# EAGLE design USB2TTL (EAGLE 6.2)
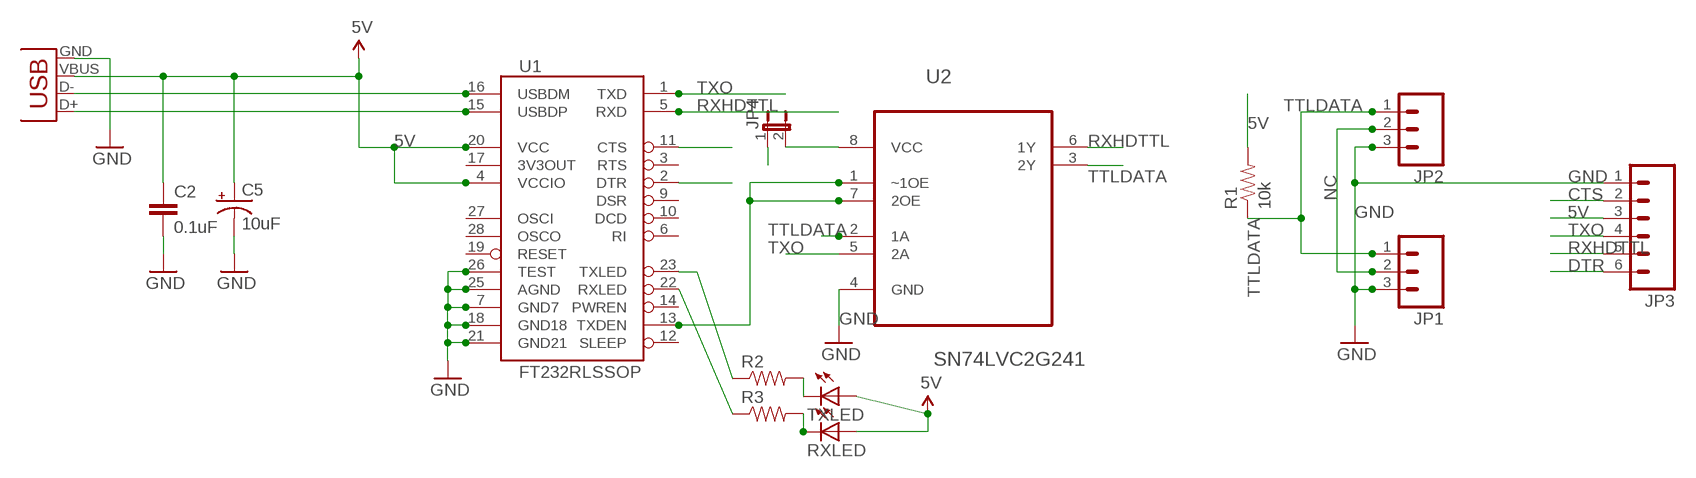
[diagram p0: schematic, sheet 1]

## Parts
C2  0.1uF  CAP0402-CAP  [0402-CAP]
C5  10uF  CAP_POL1206  [EIA3216]
JP1  M03LOCK_LONGPADS  [1X03_LOCK_LONGPADS]
JP2  M03LOCK_LONGPADS  [1X03_LOCK_LONGPADS]
JP3  M06LOCK  [1X06_LOCK]
JP4  JUMPER-2-OLDSMD-NO  [SJ_2S-NO]
R1  10k  RESISTOR0603-RES  [0603-RES]
R2  RESISTOR0603-RES  [0603-RES]
R3  RESISTOR0603-RES  [0603-RES]
RXLED  LED0603  [LED-0603]
TXLED  LED0603  [LED-0603]
U1  FT232RLSSOP  [SSOP28DB]
U2  SN74LVC2G241  [SOP65P400X130-8N]
X2  USB-SMD-NS  [USB-MINIB-NOSTOP]

## Nets
5V: C2.1 C5.A(+) JP3.3 JP4.1 R1.2 RXLED.A TXLED.A U1.4(VCCIO) U1.20(VCC) X2.VBUS
CTS: JP3.2 U1.11(CTS)
DTR: JP3.6 U1.2(DTR)
GND [power]: C2.2 C5.C(-) JP1.3 JP2.3 JP3.1 U1.7(GND7) U1.18(GND18) U1.21(GND21) U1.25(AGND) U1.26(TEST) U2.4(GND) X2.GND
N$1: JP4.2 U2.8(VCC)
N$2: R2.1 U1.23(TXLED)
N$3: R3.1 U1.22(RXLED)
N$4: R2.2 TXLED.C
N$6: R3.2 RXLED.C
NC: JP1.2 JP2.2
RXHDTTL: JP3.5 U1.5(RXD) U2.6(1Y)
TTLDATA: JP1.1 JP2.1 R1.1 U2.2(1A) U2.3(2Y)
TXDEN: U1.13(TXDEN) U2.1(~1OE) U2.7(2OE)
TXO: JP3.4 U1.1(TXD) U2.5(2A)
USB_D+: U1.15(USBDP) X2.D+
USB_D-: U1.16(USBDM) X2.D-
Unconnected: U1.3(RTS) U1.6(RI) U1.9(DSR) U1.10(DCD) U1.12(SLEEP) U1.14(PWREN) U1.17(3V3OUT) U1.19(RESET) U1.27(OSCI) U1.28(OSCO)

## Library data of the parts
C2 = SparkFun:CAP: Capacitor Standard 0603 ceramic capacitor, and 0.1" leaded capacitor.
C5 = SparkFun:CAP_POL: Capacitor Polarized These are standard SMD and PTH capacitors. Normally 10uF, 47uF, and 100uF in electrolytic and tantalum varieties. Always verify the external diameter of the through hole cap, it varies with capacity, voltage, and manufacturer. The EIA devices should be standard.
JP1 JP2 = SparkFun-Connectors:M03: Header 3 Standard 3-pin 0.1" header. Use with straight break away headers (SKU : PRT-00116), right angle break away headers (PRT-00553), swiss pins (PRT-00743), machine pins (PRT-00117), and female headers (PRT-00115). Molex polarized connector foot print use with SKU : PRT-08232 with associated crimp pins and housings.
JP3 = SparkFun-Connectors:M06: Header 6 Standard 6-pin 0.1" header. Use with straight break away headers (SKU : PRT-00116), right angle break away headers (PRT-00553), swiss pins (PRT-00743), machine pins (PRT-00117), and female headers (PRT-00115). Molex polarized connector foot print use with SKU : PRT-08094 with associated crimp pins and housings. NOTES ON THE VARIANTS LOCK and LOCK_LONGPADS... This footprint was designed to help hold the alignment of a through-hole component (i.e. 6-pin header) while soldering it into place. You may notice that each hole has been shifted either up or down by 0.005 of an inch from it's more standard position (which is a perfectly straight line). This slight alteration caused the pins (the squares in the middle) to touch the edges of the holes. Because they are alternating, it causes a "brace" to hold the component in place. 0.005 has proven to be the perfect amount of "off-center" position when using our standard breakaway headers. Although looks a little odd when you look at the bare footprint, once you have a header in there, the alteration is very hard to notice. Also, if you push a header all the way into place, it is covered up entirely on the bottom side. This idea of altering the position of holes to aid alignment will be further integrated into the Sparkfun Library for other footprints. It can help hold any component with 3 or more connection pins.
JP4 = SparkFun-Passives:JUMPER-2-OLD: Jumper Basic 0.1" spaced jumper. Use with breakaway headers.
R1 = custom-cap0603:RESISTOR: Resistor
R2 R3 = SparkFun-Passives:RESISTOR: Resistor
RXLED TXLED = SparkFun-LED:LED: LEDs Standard schematic elements and footprints for 5mm, 3mm, 1206, and 0603 sized LEDs. 5mm - Spark Fun Electronics SKU : COM-00529 (and others)
U1 = SparkFun:FT232RL: USB UART FT232RL 4th Generation USB UART (USB <-> Serial) Controller. Spark Fun Electronics SKU : COM-00650
U2 = Texas Instruments_By_element14_Batch_1:SN74LVC2G241
X2 = SparkFun:USB: USB Connectors USB-B-PTH is fully proven SKU : PRT-00139 USB-miniB is fully proven SKU : PRT-00587 USB-A-PCB is untested. USB-A-H is throughly reviewed, but untested. Spark Fun Electronics SKU : PRT-00437 USB-B-SMT is throughly reviewed, but untested. Needs silkscreen touching up. USB-A-S has not been used/tested USB-MB-H has not been used/tested

## Net classes
0 default: width 0.203 mm
1 power: width 0.254 mm

## Board
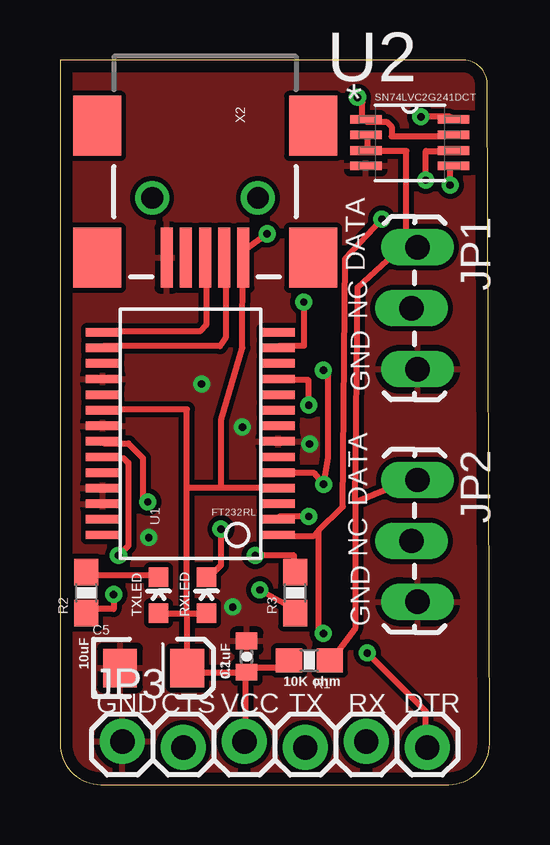
[diagram p1: board, top side]
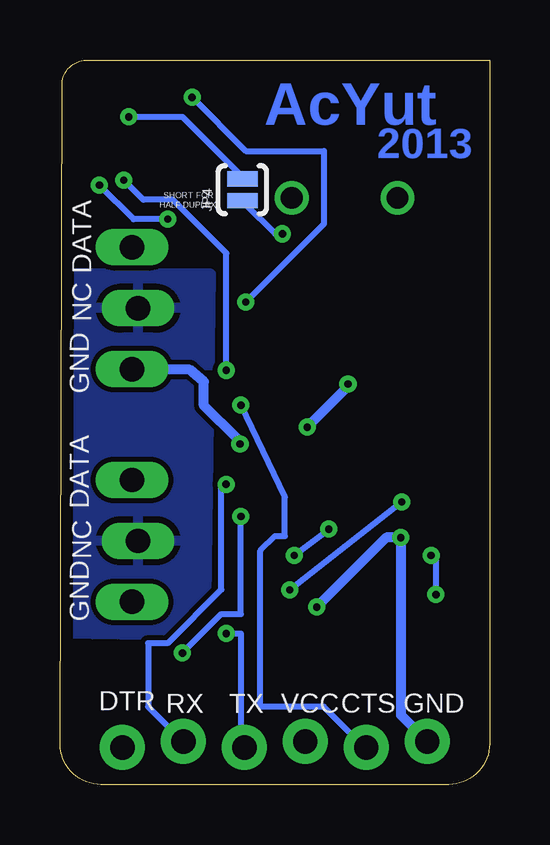
[diagram p2: board, bottom side, seen from below]

Size 17.9 x 30.21 mm. Coordinates in mm from the lower left corner, seen from the top.
Outline: 0,30.2 0,1.7 arc90 1.7,0 16.2,0 arc90 17.9,1.7 17.8,29.33 arc90 16.63,30.2 0,30.2
Copper layers (1*16): Top 0.035mm / dielectric 1.5mm / Bottom 0.035mm
Design rules: minimum track width 10mil, minimum drill 12mil, track to track 8mil, track to pad 8mil, pad to pad 8mil, via to via 8mil, smd to smd 8mil, copper to edge 20mil, drill to drill 8mil, minimum pad ring 10mil, minimum via ring 8mil, stop-mask expansion 4mil, vias tented up to drill 13mil, thermal gap 10mil

### Footprints (pad centres in the part's own frame; a part is rotated, then mirrored left to right if it is on the bottom)
0402-CAP = smd 0.7 x 0.9: 1 -0.65,0; 2 0.65,0
EIA3216 = smd 1.4 x 1.6: A 1.4,0; C -1.4,0
1X03_LOCK_LONGPADS = drill 1.016 long: 1 0,0; 2 2.54,-0.254; 3 5.08,0
1X06_LOCK = drill 1.016 pad 1.88: 1 0,0; 2 2.54,-0.254; 3 5.08,0; 4 7.62,-0.254; 5 10.16,0; 6 12.7,-0.254
SJ_2S-NO = smd 0.635 x 1.27: 1 -0.45,0; 2 0.45,0
0603-RES = smd 1.1 x 1: 1 -0.85,0; 2 0.85,0
LED-0603 = smd 0.8 x 0.8: A 0,-0.75; C 0,0.75
SSOP28DB = smd 0.348 x 1.397: 1 -4.225,-3.656; 2 -3.575,-3.656; 3 -2.925,-3.656; 4 -2.275,-3.656; 5 -1.625,-3.656; 6 -0.975,-3.656; 7 -0.325,-3.656; 8 0.325,-3.656; 9 0.975,-3.656; 10 1.625,-3.656; 11 2.275,-3.656; 12 2.925,-3.656; 13 3.575,-3.656; 14 4.225,-3.656; 15 4.225,3.656; 16 3.575,3.656; 17 2.925,3.656; 18 2.275,3.656; 19 1.625,3.656; 20 0.975,3.656; 21 0.325,3.656; 22 -0.325,3.656; 23 -0.975,3.656; 24 -1.625,3.656; 25 -2.275,3.656; 26 -2.925,3.656; 27 -3.575,3.656; 28 -4.225,3.656
SOP65P400X130-8N = smd 1.321 x 0.356: 1 -1.829,0.965; 2 -1.829,0.33; 3 -1.829,-0.33; 4 -1.829,-0.965; 5 1.829,-0.965; 6 1.829,-0.33; 7 1.829,0.33; 8 1.829,0.965
USB-MINIB-NOSTOP = smd 2.5 x 0.5: D+ 2.5,0; D- 2.5,0.8; GND 2.5,-1.6; ID 2.5,-0.8; VBUS 2.5,1.6 | smd 2.5 x 2: G1 -3,-4.5; G2 -3,4.5; G3 2.5,4.5; G4 2.5,-4.5 | drill 0.9 pad 0.8: H1 0,2.2 | drill 0.9 pad 0.787: H2 0,-2.2

### Placement (x,y rotation side)
C2  7.77,5.34 90 top
C5  3.9,4.86 0 top
JP1  14.9,22.4 270 top
JP2  14.9,12.7 270 top
JP3  2.6,1.8 0 top
JP4  10.3,24.8 90 bottom
R1  10.39,5.17 180 top
R2  1.1,8 90 top
R3  9.8,8 90 top
RXLED  6.1,7.9 0 top
TXLED  4.1,7.9 0 top
U1  5.43,14.63 90 top
U2  14.57,26.76 0 top
X2  6.04,24.46 270 top

### Tracks (layer width: path | path; a pad name or v marks a point on that pad's centre or on a via)
5V  (via drill 0.3)
  Top 0.254: v8.63,22.96 7.52,22.15 X2.VBUS 7.62,21.95 7.6,18.2 6.72,15.22 6.72,12.39 | R1.2 9.35,5.08 9.35,4.88 7.92,4.88 C2.1 7.72,4.67 | 5.28,7.11 6.1,7.11 RXLED.A | 5.28,7.11 4.27,7.11 TXLED.A | 5.28,12.39 6.72,12.39 | 6.72,12.39 8.94,12.39 U1.4 | 5.28,7.11 5.28,12.39 | 5.28,12.39 5.28,15.65 1.83,15.65 U1.20 | 5.28,7.11 5.28,4.88 C5.A 5.49,4.67 7.72,4.67 | 7.72,4.67 7.72,1.83 JP3.3
  Bottom 0.254: v8.63,22.96 8.94,22.96 10.16,24.18 JP4.1
CTS  (via drill 0.3)
  Top 0.254: v10.36,15.82 10.36,16.87 9.14,16.87 U1.11
  Bottom 0.254: v10.36,15.82 8.53,11.99 8.53,10.36 8.94,10.36 9.55,9.75 9.55,3.25 6.91,3.25 5.28,1.63 JP3.2
DTR  (via drill 0.3)
  Top 0.254: v10.36,11.18 9.14,11.18 U1.2 | v12.8,5.49 15.24,3.05 15.24,1.63 JP3.6
  Bottom 0.254: v10.36,11.18 10.36,7.11 11.18,7.11 v12.8,5.49
GND  (via drill 0.3)
  Bottom 0.406: JP3.1 3.7,2.9 v3.7,10.3 4.3,10.3 v7.2,7.4 | v10.4,14.2 10.5,14.4 11.9,15.8 11.9,16.8 12.5,17.3 14.88,17.3 JP1.3 | v5.9,16.7 5.9,16.6 v7.6,14.9
  pour Top: 17.87,29.73 17.72,0.91 arc-89 16.96,0.15 -0.08,-0.07 -0.05,29.71
N$1  (via drill 0.3)
  Top 0.254: v15.04,27.84 16.26,27.84 U2.8
  Bottom 0.254: v15.04,27.84 12.8,27.84 10.36,25.4 JP4.2
N$2  (via drill 0.3)
  Top 0.254: v2.23,7.92 2.23,7.32 1.22,7.32 R2.1 | v2.44,9.55 2.85,9.96 2.85,13.41 2.64,13.61 1.83,13.61 U1.23
  Bottom 0.254: v2.23,7.92 2.23,9.55 v2.44,9.55
N$3  (via drill 0.3)
  Top 0.254: v8.33,8.12 9.75,7.32 R3.1 | v3.66,11.79 3.45,11.99 3.45,13.61 2.85,14.22 1.83,14.22 U1.22
  Bottom 0.254: v3.66,11.79 v8.33,8.12
N$4
  Top 0.254: TXLED.C 4.06,8.74 1.22,8.74 R2.2
N$6  (via drill 0.3)
  Top 0.254: 6.1,8.74 RXLED.C 6.3,8.74 6.71,9.14 v6.71,10.65 | v8.14,9.55 9.75,9.55 9.75,8.94 R3.2
  Bottom 0.254: v6.71,10.65 6.81,10.55 v8.14,9.55
NC
  pour Bottom: 11.6,21.3 17.6,21.3 17.8,6.3 11.8,6.2
RXHDTTL  (via drill 0.3)
  Top 0.254: v15.24,25.2 15.24,26.42 16.26,26.42 U2.6 | v10.97,17.27 11.18,17.07 11.18,13.61 v10.98,12.52 10.57,13.01 9.14,13.01 U1.5
  Bottom 0.254: v15.24,25.2 14.43,24.38 13.21,24.38 10.97,22.15 v10.97,17.27 11.18,17.27 | JP3.5 12.8,1.83 14.22,3.25 14.22,5.89 13.41,5.89 11.18,8.13 11.18,12.42 v10.98,12.52
TTLDATA
  Top 0.254: 12.8,26.42 12.8,27.03 U2.2 | 12.8,26.42 14.43,26.42 14.43,22.96 14.63,22.76 | 14.63,22.76 14.83,22.55 JP1.1 14.63,22.76 | 12.8,26.42 U2.3 | 12.3,11.77 12.3,6.5 11.38,5.28 R1.1 | 12.3,11.77 14.83,12.8 JP2.1 | 14.63,22.76 12.4,20.73 12.3,11.77
TXDEN  (via drill 0.3)
  Top 0.254: U2.7 16.26,27.03 13.82,27.03 13.82,27.43 13.61,27.64 12.8,27.64 U2.1 12.6,27.84 12.6,28.45 v12.39,28.65 | v10.16,20.12 10.16,18.29 9.14,18.29 U1.13
  Bottom 0.254: v10.16,20.12 6.91,23.37 6.91,26.42 10.16,26.42 v12.39,28.65
TXO  (via drill 0.3)
  Top 0.254: v16.26,24.99 16.26,25.81 U2.5 | v13.41,23.57 11.89,21.95 11.79,11.58 10.77,10.57 | 10.77,10.57 10.57,10.36 9.14,10.36 U1.1 | v10.97,6.3 10.77,6.5 10.77,10.57
  Bottom 0.254: v16.26,24.99 14.83,23.57 v13.41,23.57 | v10.97,6.3 10.36,6.3 10.36,1.63 JP3.4
USB_D+
  Top 0.254: U1.15 1.83,18.9 5.84,18.9 6.09,19.15 6.09,21.95 X2.D+
USB_D-
  Top 0.254: U1.16 1.83,18.29 6.66,18.28 6.91,18.64 6.91,21.95 X2.D-

### Text on the board
Bottom: AcYut | 2013
tPlace: SN74LVC2G241DCT | DATA | NC | GND | DATA | FT232RL | NC | TXLED | RXLED | GND | 10uF | 0.1uF | 10K ohm | TX | RX | GND | CTS | VCC | DTR
bPlace: SHORT FOR | HALF DUPLEX | DATA | NC | GND | DATA | NC | GND | TX | RX | GND | CTS | VCC | DTR